# Altium schematic sheet DX-PJ20-V1.1_SCH_Part_AD.SchDoc
size A4; SheetNumber: 1; SheetTotal: 1
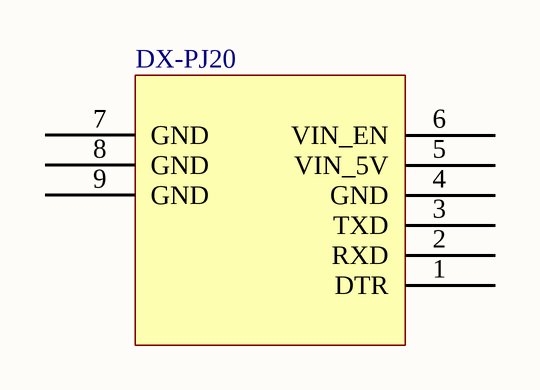
[diagram p0: DX-PJ20-V1.1_SCH_Part_AD.SchDoc]

## Parts
DX-PJ20  *  (value not drawn)

## Nets

Not connected (* = marked no-connect by the designer): DX-PJ20 1(DTR) 2(RXD) 3(TXD) 4(GND) 5(VIN_5V) 6(VIN_EN) 7(GND) 8(GND) 9(GND)